# Altium schematic sheet PIC32_Subsystem.SchDoc
size A; SheetNumber: 5; SheetTotal: 15
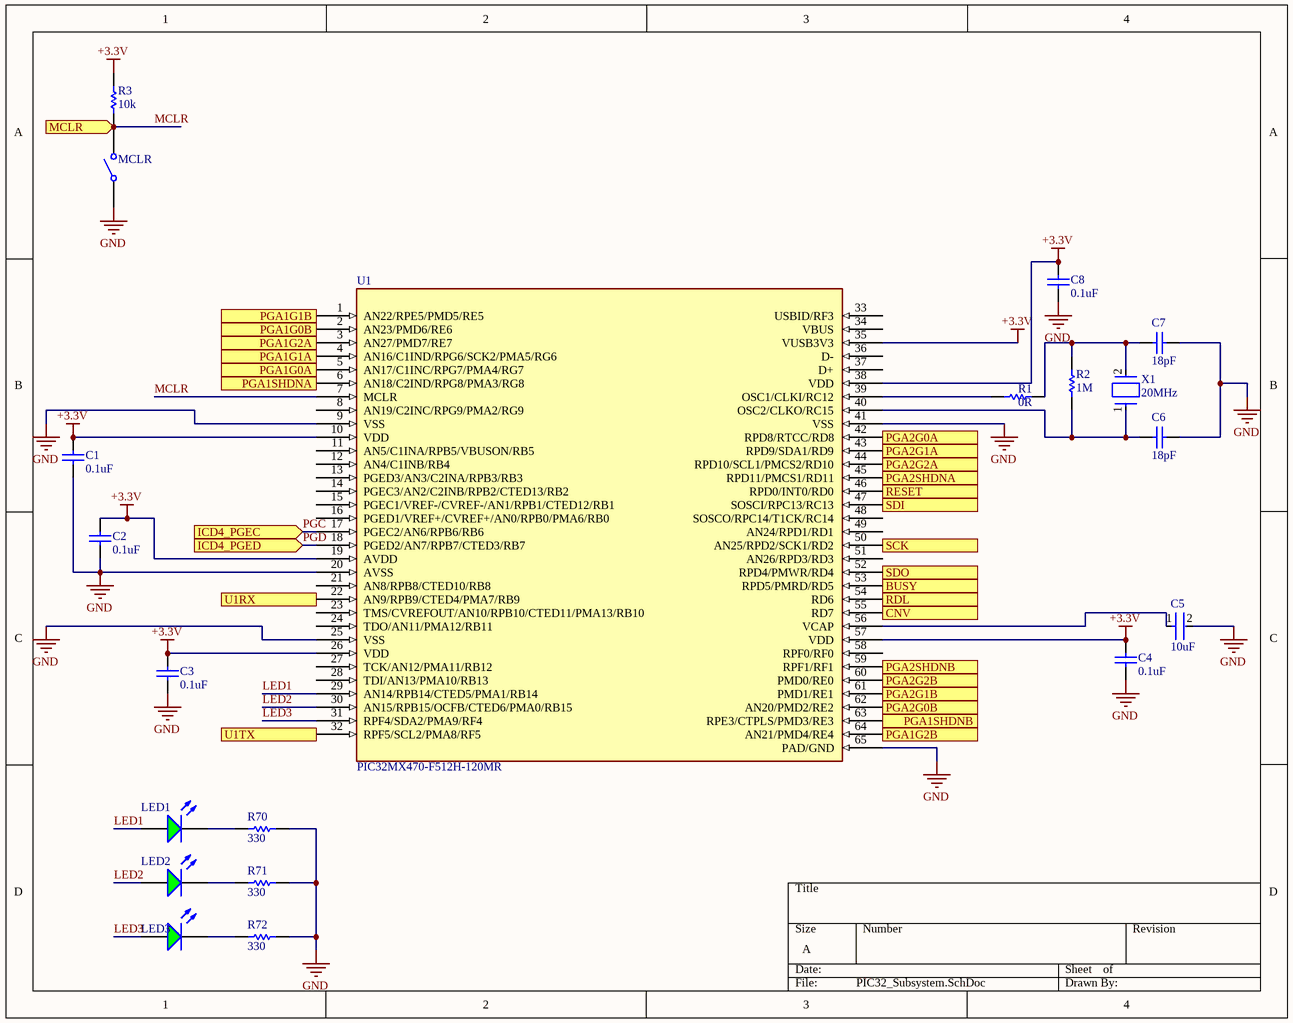
[diagram p0: PIC32_Subsystem.SchDoc]

## Parts
C1  0.1uF  [CAPC1050X55X23ML05T13]
C2  0.1uF  [CAPC1050X55X23ML05T13]
C3  0.1uF  [CAPC1050X55X23ML05T13]
C4  0.1uF  [CAPC1050X55X23ML05T13]
C5  10uF  [FP-GRM188-0_1-e0_2_0_55-IPC_A]
C6  18pF  [CAPC1005X55X25LL05T10]
C7  18pF  [CAPC1005X55X25LL05T10]
C8  0.1uF  [CAPC1050X55X23ML05T13]
LED1  (no value)  [KING-APT1608SGC_V]
LED2  (no value)  [KING-APT1608SGC_V]
LED3  (no value)  [KING-APT1608SGC_V]
MCLR  434121043816  [434121043816]  (value not drawn)
R1  0R  [RESC1005X40X25NL05T10]
R2  1M  [RESC1005X40X25LL05T05]
R3  10k  [RESC1005X40X25LL05T05]
R70  330  [RESC1609X50X30LL10T20]
R71  330  [RESC1609X50X30LL10T20]
R72  330  [RESC1609X50X30LL10T20]
U1  PIC32MX470-F512H-120MR  [TQFP]
X1  20MHz  [FP-ABM7-MFG]

## Ports
BUSY (in), CNV (out), ICD4_PGEC (in), ICD4_PGED (in), MCLR (in), PGA1G0A (out), PGA1G0B (out), PGA1G1A (out), PGA1G1B (out), PGA1G2A (out), PGA1G2B (out), PGA1SHDNA (out), PGA1SHDNB (out), PGA2G0A (out), PGA2G0B (out), PGA2G1A (out), PGA2G1B (out), PGA2G2A (out), PGA2G2B (out), PGA2SHDNA (out), PGA2SHDNB (out), RDL (out), RESET (out), SCK (out), SDI (in), SDO (out), U1RX (in), U1TX (out)

## Nets
+3.3V: C1.2 C2.2 C3.2 C4.2 C8.2 R3.2 U1.10(VDD) U1.19(AVDD) U1.26(VDD) U1.35(VUSB3V3) U1.38(VDD) U1.57(VDD)
GND: C1.1 C2.1 C3.1 C4.1 C5.2 C6.2 C7.2 C8.1 MCLR.1 R70.2 R71.2 R72.2 U1.9(VSS) U1.20(AVSS) U1.25(VSS) U1.41(VSS) U1.65(PAD/GND)
BUSY: U1.53(RPD5/PMRD/RD5) ; port BUSY
CNV: U1.55(RD7) ; port CNV
LED1: LED1.1(A) U1.29(AN14/RPB14/CTED5/PMA1/RB14)
LED2: LED2.1(A) U1.30(AN15/RPB15/OCFB/CTED6/PMA0/RB15)
LED3: LED3.1(A) U1.31(RPF4/SDA2/PMA9/RF4)
MCLR: MCLR.2 R3.1 U1.7(MCLR) ; port MCLR
PGA1G0A: U1.5(AN17/C1INC/RPG7/PMA4/RG7) ; port PGA1G0A
PGA1G0B: U1.2(AN23/PMD6/RE6) ; port PGA1G0B
PGA1G1A: U1.4(AN16/C1IND/RPG6/SCK2/PMA5/RG6) ; port PGA1G1A
PGA1G1B: U1.1(AN22/RPE5/PMD5/RE5) ; port PGA1G1B
PGA1G2A: U1.3(AN27/PMD7/RE7) ; port PGA1G2A
PGA1G2B: U1.64(AN21/PMD4/RE4) ; port PGA1G2B
PGA1SHDNA: U1.6(AN18/C2IND/RPG8/PMA3/RG8) ; port PGA1SHDNA
PGA1SHDNB: U1.63(RPE3/CTPLS/PMD3/RE3) ; port PGA1SHDNB
PGA2G0A: U1.42(RPD8/RTCC/RD8) ; port PGA2G0A
PGA2G0B: U1.62(AN20/PMD2/RE2) ; port PGA2G0B
PGA2G1A: U1.43(RPD9/SDA1/RD9) ; port PGA2G1A
PGA2G1B: U1.61(PMD1/RE1) ; port PGA2G1B
PGA2G2A: U1.44(RPD10/SCL1/PMCS2/RD10) ; port PGA2G2A
PGA2G2B: U1.60(PMD0/RE0) ; port PGA2G2B
PGA2SHDNA: U1.45(RPD11/PMCS1/RD11) ; port PGA2SHDNA
PGA2SHDNB: U1.59(RPF1/RF1) ; port PGA2SHDNB
PGC: U1.17(PGEC2/AN6/RPB6/RB6) ; port ICD4_PGEC
PGD: U1.18(PGED2/AN7/RPB7/CTED3/RB7) ; port ICD4_PGED
RDL: U1.54(RD6) ; port RDL
RESET: U1.46(RPD0/INT0/RD0) ; port RESET
SCK: U1.50(AN25/RPD2/SCK1/RD2) ; port SCK
SDI: U1.47(SOSCI/RPC13/RC13) ; port SDI
SDO: U1.52(RPD4/PMWR/RD4) ; port SDO
U1RX: U1.22(AN9/RPB9/CTED4/PMA7/RB9) ; port U1RX
U1TX: U1.32(RPF5/SCL2/PMA8/RF5) ; port U1TX
NetC5_1: C5.1 U1.56(VCAP)
NetC6_1: C6.1 R2.1 U1.40(OSC2/CLKO/RC15) X1.1
NetC7_1: C7.1 R1.2 R2.2 X1.2
NetLED1_2: LED1.2(K) R70.1
NetLED2_2: LED2.2(K) R71.1
NetLED3_2: LED3.2(K) R72.1
NetR1_1: R1.1 U1.39(OSC1/CLKI/RC12)

Not connected (* = marked no-connect by the designer): U1 8(AN19/C2INC/RPG9/PMA2/RG9) 11(AN5/C1INA/RPB5/VBUSON/RB5) 12(AN4/C1INB/RB4) 13(PGED3/AN3/C2INA/RPB3/RB3) 14(PGEC3/AN2/C2INB/RPB2/CTED13/RB2) 15(PGEC1/VREF-/CVREF-/AN1/RPB1/CTED12/RB1) 16(PGED1/VREF+/CVREF+/AN0/RPB0/PMA6/RB0) 21(AN8/RPB8/CTED10/RB8) 23(TMS/CVREFOUT/AN10/RPB10/CTED11/PMA13/RB10) 24(TDO/AN11/PMA12/RB11) 27(TCK/AN12/PMA11/RB12) 28(TDI/AN13/PMA10/RB13) 33(USBID/RF3) 34(VBUS) 36(D-) 37(D+) 48(SOSCO/RPC14/T1CK/RC14) 49(AN24/RPD1/RD1) 51(AN26/RPD3/RD3) 58(RPF0/RF0)

## Library data of the parts
C1-C4 C8 = CMP-2000-05439-1: Chip Capacitor, 100 nF, +/- 10%, 16 V, -55 to 125 degC, 0402 (1005 Metric), RoHS, Tape and Reel / CL05B104KO5NNNC; Manufacturer: Samsung Electro-Mechanics; Capacitance: 100000pF; Dielectric: X7R; Rated Voltage: 16V; Case Size/Dimension: 0402; Tolerance (%): ±10%; Manufacturer URL: http://www.samsungsem.com/global/index.jsp; Datasheet URL: https://datasheet.ciiva.com/29198/458718-da-01-en-vs-kondensator-0402-29198423.pdf; Datasheet Version: Nov-10
C5 = CMP-2006-02792-2: Chip Multilayer Ceramic Capacitors for General Purpose, 0603, 10uF, X5R, 15%, 20%, 6.3V / GRM188R60J106ME47D; Packaging: Tape and Reel; Voltage Rating (DC): 6.3V; Width: 0.031inch; Termination: SMD/SMT; Dielectric: X5R; Package Quantity: 4000; Voltage Rating: 6.3V; Capacitance: 10uF; Case/Package: 0603; Min Operating Temperature: -55°C; Voltage: 6.3V; Length: 1.6mm; Thickness: 0.035inch; Lead Free: Lead Free; Depth: 0.8mm; Case Code (Imperial): 0603; Max Operating Temperature: 85°C; Material: Ceramic; Height: 0.8mm; Tolerance: 20%; Mount: Surface Mount; REACH SVHC: No SVHC; Radiation Hardening: No; Case Code (Metric): 1608
C6 C7 = CMP-2008-04271-1: GRM1555C1H180GA01D; Manufacturer: Murata; Part Number: GRM1555C1H180GA01D
LED1-LED3 = CMP-2000-05789-1: Super Bright Green LED, 62.5 mW, 25 mA, -40 to 85 degC, 2-Pin SMD, RoHS, Tape and Reel, APT1608SGC; Manufacturer: Kingbright; Online Catalog: 0603RectanglewithFlatTopChipLEDs; Wavelength - Dominant: 568nm; Wavelength - Peak: 565nm; Voltage - Forward (Vf) (Typ): 2.2V; Lens Type: Clear; Other Names: 754-1121-2; Millicandela Rating: 15mcd; Catalog Drawings: APT1608SeriesTop / APT1608SeriesSide; Lens Style/Size: RectanglewithFlatTop,1.2mmx0.8mm; Current - Test: 20mA; 3D Model: APT1608x.sldprt / APT1608x.pro / APT1608x.igs / APT1608x.stp; Viewing Angle: 120°; Package / Case: 0603(1608Metric); Category: Optoelectronics; Package Description: 2-Pin Surface Mount Device, Body 0.8 x 1.6 mm; Mounting Type: SurfaceMount; Color: Green; Height: 0.75mm; Datasheet Version: Rev. 16B, 02/2012; Family: LEDIndication-Discrete; Manufacturer URL: http://www.kingbright.com/; Package Reference: APT1608SGC; Datasheet URL: https://datasheet.ciiva.com/2113/apt1608sgc-2113808.pdf; Mounting Technology: SurfaceMount; Packaging: Tape&Reel(TR); Standard Package: 2,000; Size / Dimension: 1.60mmLx0.80mmW
MCLR = CMP-1459-00005-1: WS-TASV SMD Tact Switch 6.0X3.5 mm; Manufacturer: Wuerth Elektronik; NoPins: 02; ComponentLink1URL: http://www.we-online.com; PartNumber: 434121043816; ComponentLink2URL: http://katalog.we-online.de/em/datasheet/434121043816.pdf; ComponentLink2Description: Datasheet; ComponentLink1Description: Manufacturer URL; PackageReference: 434121043816
R1 = CMP-1011-00001-2: RC0402JR-070RL; Manufacturer: Yageo / Phycomp; Part Number: RC0402JR-070RL
R2 = CMP-2002-00609-3: Chip Resistor, 1 MOhm, +/- 1%, 100 mW, -55 to 155 degC, 0402 (1005 Metric), RoHS, Tape and Reel / ERJ-2RKF1004X; Manufacturer: Basic Passives; Voltage Rating: 50 V; Case\/Package: 0402; Resistance: 1 MOhm; Power Rating: 100 mW; Pins: 2; Max Operating Temperature: 155 degC; ComponentLink2URL: http://industrial.panasonic.com/cdbs/www-data/pdf/RDA0000/AOA0000C86.pdf; Weight: 2.8E-05oz; ComponentLink1URL: http://www.panasonic.com/; Radiation Hardening: No; Height: 0.35 mm; Case Code (Imperial): 0402; ComponentLink2Description: Datasheet; Mount: Surface Mount; ComponentLink1Description: Manufacturer URL; REACH SVHC: Yes; PartNumber: ERJ-2RKF1004X; Length: 1 mm; Min Operating Temperature: -55 degC; Width: 0.5 mm; Package Quantity: 10000; Tolerance: 1%; PackageDescription: 2-Pin Surface Mount Device, Body 1 x 0.5 mm; RoHSCompliant: true; DatasheetVersion: 04/2015; PackageReference: 0402; Mounting Technology: Surface Mount; Case Code (Metric): 1005; Packaging: Tape and Reel
R3 = CMP-2000-07588-1: Chip Resistor, 10 KOhm, +/- 1%, 0.1 W, -55 to 155 degC, 0402 (1005 Metric), RoHS, Tape and Reel / ERJ2RKF1002X; Manufacturer: Panasonic; Power Rating: 100mW; Voltage Rating: 50V; Resistance: 10KOhm; Case\/Package: 0402; Temperature Coefficient: 100ppm\/degreesC; RoHSCompliant: True; Lead Free: LeadFree; Package Quantity: 1; Contact Plating: Tin; Length: 1mm; Radiation Hardening: No; REACH SVHC: NoSVHC; Max Operating Temperature: 155degC; Depth: 0.5mm; Case Code (Imperial): 0402; Military Standard: Not; Package Description: 2-Pin Surface Mount Device, Body 1 x 0.5 mm; Termination: SMD/SMT; Case Code (Metric): 1005; Height: 0.35mm; Packaging: TapeandReel; Voltage Rating (DC): 50V; Package Reference: 402; Number of Pins: 2; Tolerance: 1%; Mounting Technology: SurfaceMount; Width: 0.02inch; Mount: SurfaceMount; Datasheet URL: https://industrial.panasonic.com/cdbs/www-data/pdf/RDA0000/AOA0000C304.pdf; Composition: ThickFilm; Datasheet Version: 02/2017; Manufacturer URL: http://www.panasonic.com/; Max Power Dissipation: 100mW; Number of Terminations: 2; Min Operating Temperature: -55degC
R70-R72 = CMP-1012-00062-2: CRCW0603330RJNEA; Manufacturer: Vishay Dale; Part Number: CRCW0603330RJNEA
X1 = CMP-27762-013587-1: Crystal 20MHz ±20ppm 18pF SMD-2 6mm x 3.5mm / ABM7-20.000MHZ-D2Y-T; Frequency Stability: 30ppm; ESR (Equivalent Series Resistance): 50R; Contact Plating: Gold; Load Capacitance: 18pF; Tolerance: 20ppm; Length: 6mm; Frequency: 20MHz; Lead Free: Lead Free; Package Quantity: 1000; Resistor Type: Ceramic; Min Operating Temperature: -40°C; Max Operating Temperature: 85°C; Series: ABM7; Depth: 3.5mm; Width: 0.138inch; Frequency Tolerance: 20ppm; Termination: SMD/SMT; Radiation Hardening: No; Case/Package: CSMD; Height: 0.055inch; Packaging: Tape and Reel; Operating Frequency: 20 MHz; Series Resistance: 50R; Number of Pins: 2; Mount: Surface Mount